# EAGLE design shift controller (EAGLE 9.2.2)
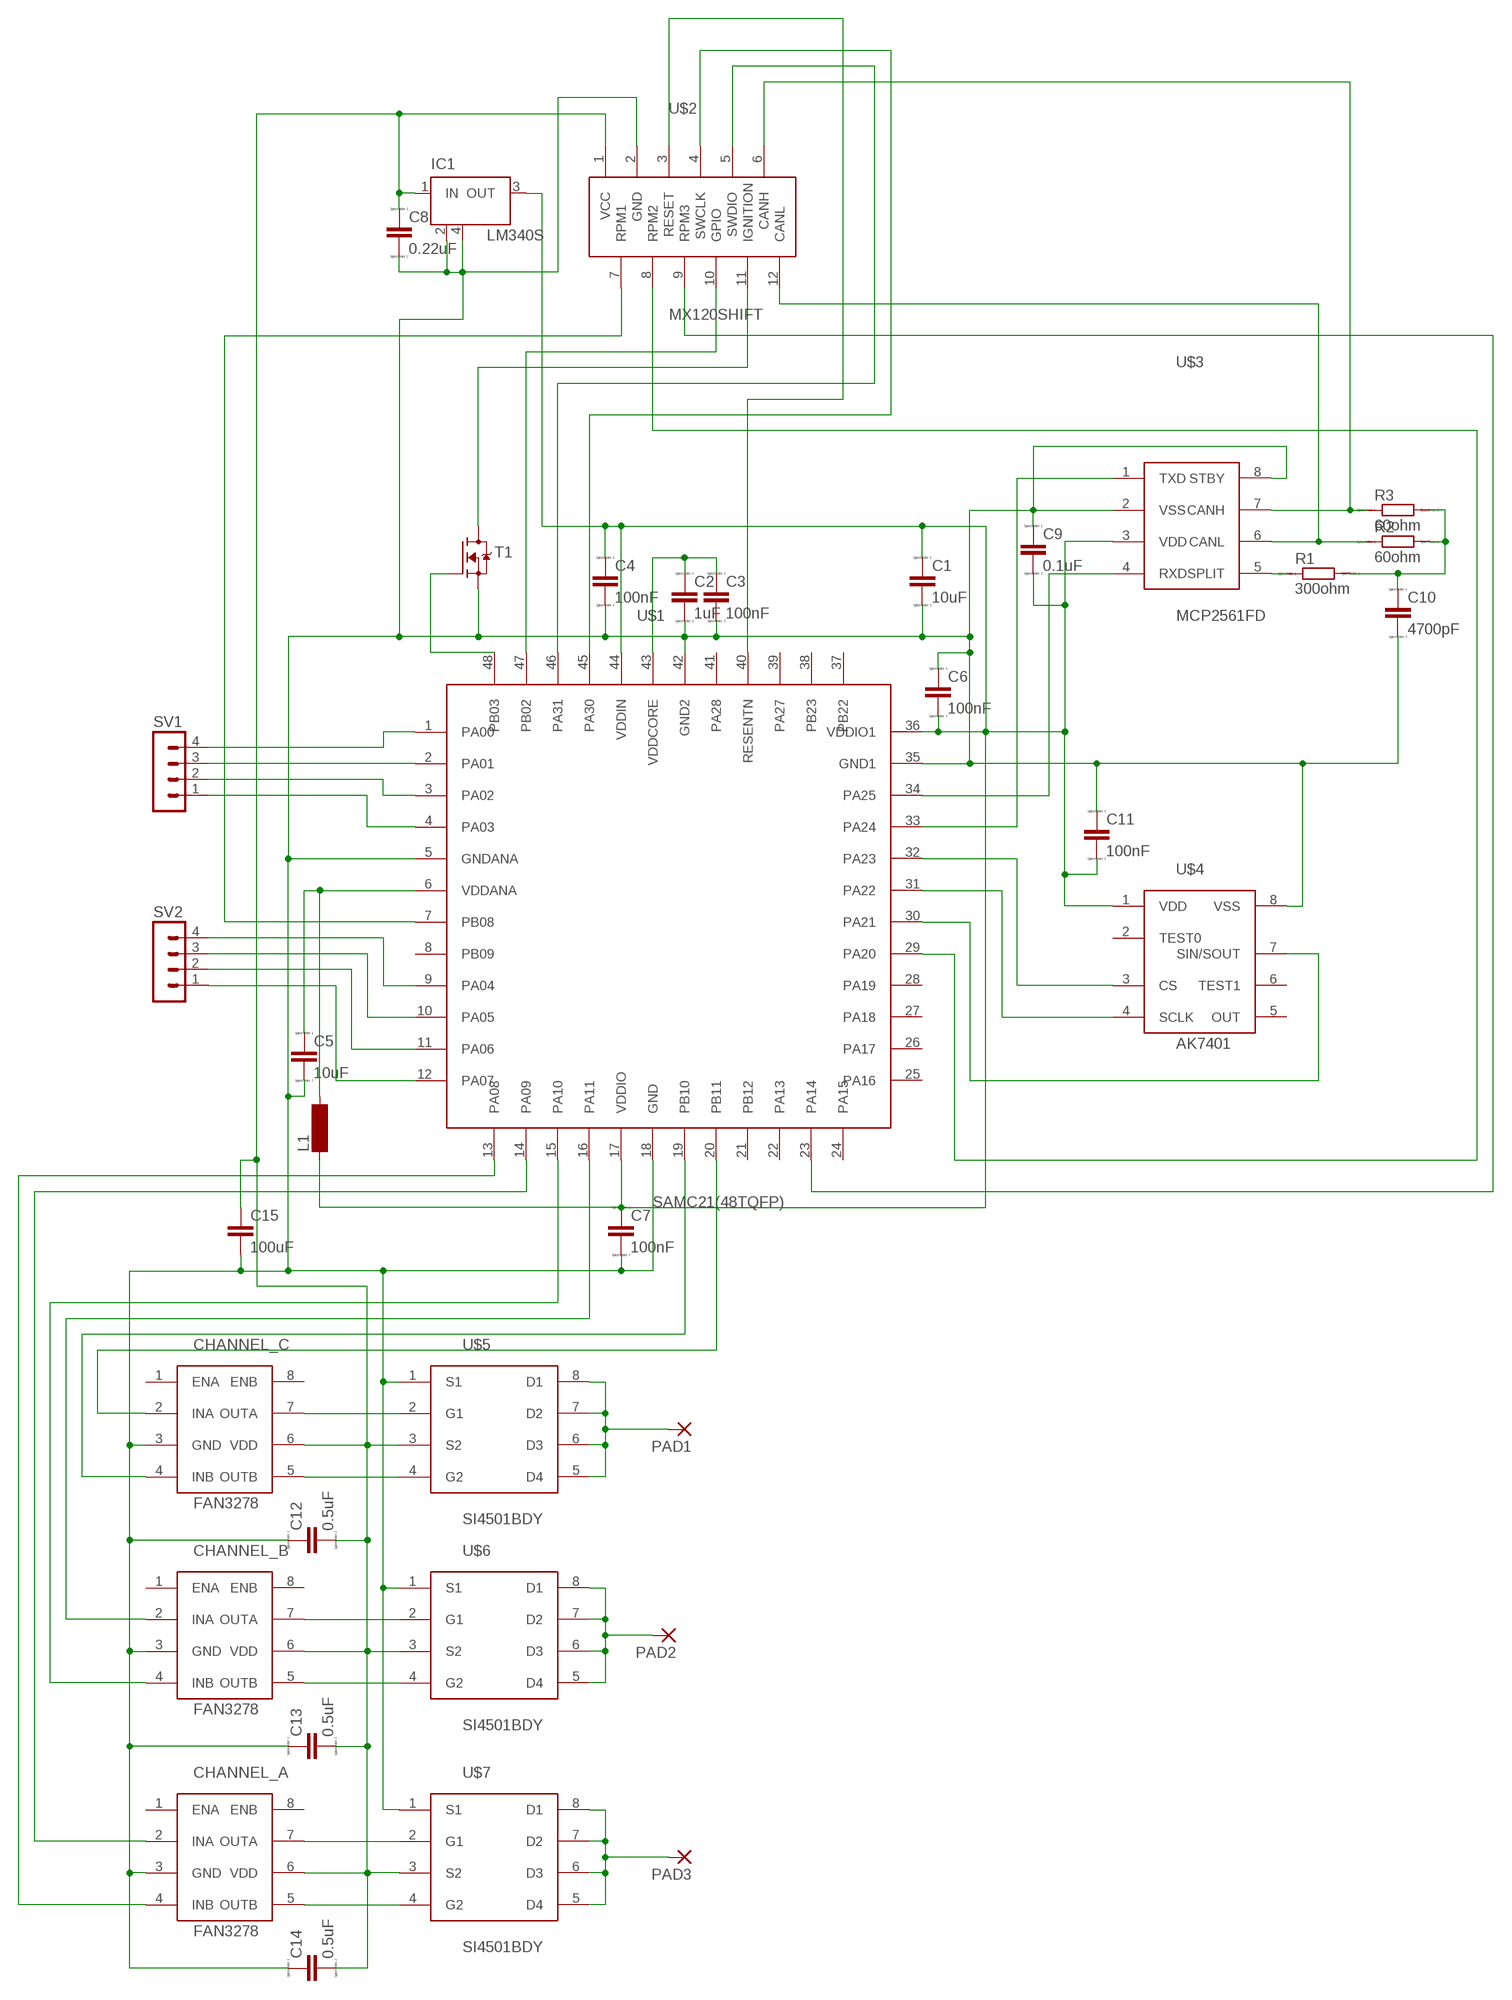
[diagram p0: schematic, sheet 1]

## Parts
C1  10uF  CC1206  [C1206]
C2  1uF  CC1206  [C1206]
C3  100nF  CC1206  [C1206]
C4  100nF  CC1206  [C1206]
C5  10uF  CC1206  [C1206]
C6  100nF  CC1206  [C1206]
C7  100nF  CC1206  [C1206]
C8  0.22uF  CC1206  [C1206]
C9  0.1uF  CC1206  [C1206]
C10  4700pF  CC1206  [C1206]
C11  100nF  CC1206  [C1206]
C12  0.5uF  CC1206  [C1206]
C13  0.5uF  CC1206  [C1206]
C14  0.5uF  CC1206  [C1206]
C15  100uF  C2.5/5  [C2.5-5]
CHANNEL_A  FAN3278  [SOIC-8]
CHANNEL_B  FAN3278  [SOIC-8]
CHANNEL_C  FAN3278  [SOIC-8]
IC1  LM340S  [SOT223]
L1  SM-1206  [SM-1206]
PAD1  3,81/1,4  [3,81/1,4]
PAD2  3,81/1,4  [3,81/1,4]
PAD3  3,81/1,4  [3,81/1,4]
R1  300ohm  RR1206  [R1206]
R2  60ohm  RR1206  [R1206]
R3  60ohm  RR1206  [R1206]
SV1  MA04-1  [MA04-1]
SV2  MA04-1  [MA04-1]
T1  MOSFET-N-SOT223  [SOT223]
U$1  SAMC21(48TQFP)  [TQFP-48]
U$2  MX120SHIFT  [12X3.5PITCH]
U$3  MCP2561FD  [SOIC-8]
U$4  AK7401  [SOIC-8]
U$5  SI4501BDY  [SOIC-8]
U$6  SI4501BDY  [SOIC-8]
U$7  SI4501BDY  [SOIC-8]

## Nets
N$1: U$1.45(PA30) U$2.4(SWCLK)
N$2: U$1.46(PA31) U$2.5(SWDIO)
N$3: U$1.34(PA25) U$3.4(RXD)
N$4: U$1.33(PA24) U$3.1(TXD)
N$5: R3.1 U$2.6(CANH) U$3.7(CANH)
N$6: R2.1 U$2.12(CANL) U$3.6(CANL)
N$7: U$1.40(RESENTN) U$2.3(RESET)
N$8: U$1.7(PB08) U$2.7(RPM1)
N$9: U$1.23(PA14) U$2.9(RPM3)
N$10: U$1.29(PA20) U$2.8(RPM2)
N$11: SV1.4 U$1.1(PA00)
N$12: C8.1 C12.2 C13.2 C14.2 C15.1 CHANNEL_A.6(VDD) CHANNEL_B.6(VDD) CHANNEL_C.6(VDD) IC1.1(IN) U$2.1(VCC) U$5.3(S2) U$6.3(S2) U$7.3(S2)
N$13: C1.1 C4.1 C6.2 C7.1 C9.2 C11.2 IC1.3(OUT) L1.1 U$1.17(VDDIO) U$1.36(VDDIO1) U$1.44(VDDIN) U$3.3(VDD) U$4.1(VDD)
N$14: C2.1 C3.1 U$1.43(VDDCORE)
N$15: C5.1 L1.2 U$1.6(VDDANA)
N$16: R1.1 U$3.5(SPLIT)
N$18: C10.1 R1.2 R2.2 R3.2
N$19: CHANNEL_C.2(INA) U$1.20(PB11)
N$20: U$1.30(PA21) U$4.7(SIN/SOUT)
N$21: U$1.31(PA22) U$4.4(SCLK)
N$22: U$1.32(PA23) U$4.3(CS)
N$23: T1.2(D) T1.4(D) U$2.11(IGNITION)
N$24: T1.1(G) U$1.48(PB03)
N$25: PAD1.1(P) U$5.5(D4) U$5.6(D3) U$5.7(D2) U$5.8(D1)
N$26: PAD2.1(P) U$6.5(D4) U$6.6(D3) U$6.7(D2) U$6.8(D1)
N$27: PAD3.1(P) U$7.5(D4) U$7.6(D3) U$7.7(D2) U$7.8(D1)
N$28: CHANNEL_C.4(INB) U$1.19(PB10)
N$29: CHANNEL_C.7(OUTA) U$5.2(G1)
N$30: CHANNEL_C.5(OUTB) U$5.4(G2)
N$31: CHANNEL_B.7(OUTA) U$6.2(G1)
N$32: CHANNEL_B.5(OUTB) U$6.4(G2)
N$33: CHANNEL_A.7(OUTA) U$7.2(G1)
N$34: CHANNEL_A.5(OUTB) U$7.4(G2)
N$35: C1.2 C2.2 C3.2 C4.2 C5.2 C6.1 C7.2 C8.2 C9.1 C10.2 C11.1 C12.1 C13.1 C14.1 C15.2 CHANNEL_A.3(GND) CHANNEL_B.3(GND) CHANNEL_C.3(GND) IC1.2(GND) IC1.4(GND) T1.3(S) U$1.5(GNDANA) U$1.18(GND) U$1.35(GND1) U$1.42(GND2) U$2.2(GND) U$3.2(VSS) U$3.8(STBY) U$4.8(VSS) U$5.1(S1) U$6.1(S1) U$7.1(S1)
N$36: CHANNEL_B.2(INA) U$1.16(PA11)
N$37: CHANNEL_B.4(INB) U$1.15(PA10)
N$38: CHANNEL_A.2(INA) U$1.14(PA09)
N$39: CHANNEL_A.4(INB) U$1.13(PA08)
N$40: U$1.47(PB02) U$2.10(GPIO)
N$41: SV1.3 U$1.2(PA01)
N$42: SV1.2 U$1.3(PA02)
N$43: SV1.1 U$1.4(PA03)
N$44: SV2.4 U$1.9(PA04)
N$45: SV2.3 U$1.10(PA05)
N$46: SV2.2 U$1.11(PA06)
N$47: SV2.1 U$1.12(PA07)
Unconnected: CHANNEL_A.1(ENA) CHANNEL_A.8(ENB) CHANNEL_B.1(ENA) CHANNEL_B.8(ENB) CHANNEL_C.1(ENA) CHANNEL_C.8(ENB) U$1.8(PB09) U$1.21(PB12) U$1.22(PA13) U$1.24(PA15) U$1.25(PA16) U$1.26(PA17) U$1.27(PA18) U$1.28(PA19) U$1.37(PB22) U$1.38(PB23) U$1.39(PA27) U$1.41(PA28) U$4.2(TEST0) U$4.5(OUT) U$4.6(TEST1)

## Library data of the parts
C1-C14 = eagle-ltspice:C: CAPACITOR, European symbol; SPICEMODEL: NONE; SPICEPREFIX: C
C15 = capacitor-wima:C: CAPACITOR naming: grid - package width
CHANNEL_A CHANNEL_B CHANNEL_C = my library 2:FAN3278: Pmos Nmos bridge driver
IC1 = linear:LM340S: 3-Terminal Positive Regulators Source: http://cache.national.com/ds/LM/LM340.pdf
L1 = inductor-neosid:SM-1206: INDUCTOR SMD chip inductor; OC_FARNELL: unknown; OC_NEWARK: unknown
PAD1-PAD3 = wirepad:3,81/1,4: THROUGH-HOLE PAD
R1-R3 = eagle-ltspice:R: RESISTOR, European symbol; SPICEMODEL: NONE; SPICEPREFIX: R
SV1 SV2 = con-lstb:MA04-1: PIN HEADER; OC_FARNELL: unknown; OC_NEWARK: unknown
T1 = we-transistor:MOSFET-N: N-Channel MOSFET SOT23 N-Chn MOSFET TSM3404, IRLML2502 (Vgs>=+/-20V, Vds<=20V, Id>=3A + Rds<=0.05Ohm @ Vgs=4.5V) BSS138 (Vgs>=+/-20V, Vds<=40V, Id>=0.2A + Rds<=3Ohm @ Vgs=4.5V) SOT223 Low Side Switch with Protection (Infineon) BSP76 (Vin=0...10V, Vds<=42V, Id=1.4A + Rds=0.2Ohm @ Vin=5V) BSP77 (Vin=0...10V, Vds<=42V, Id=2.2A + Rds=0.1Ohm @ Vin=5V) D²Pak Low Side Switch with Protection (Infineon) BTS117TC (Vin=0...10V, Vds<=60V, Id=3.5A + Rds=0.12Ohm @ Vin=5V) BTS133TC (Vin=0...10V, Vds<=60V, Id=7A + Rds=0.06Ohm @ Vin=5V) BTS141TC (Vin=0...10V, Vds<=60V, Id=12A + Rds=0.03Ohm @ Vin=5V) BTS3018TC (Vin=0...10V, Vds<=60V, Id=6A + Rds=0.02Ohm @ Vin=5V)
U$1 = my library:SAMC21(48TQFP): SAM C21 micro in 48-tqfp package
U$2 = my library 2:MX120SHIFT: MX120G connector for rear shift motor controller
U$3 = my library:MCP2561FD: CAN-FD transceiver
U$4 = my library 2:AK7401: Non-contact magnetic encoder
U$5-U$7 = my library 2:SI4501BDY: Pmos Nmos half bridge

## Board
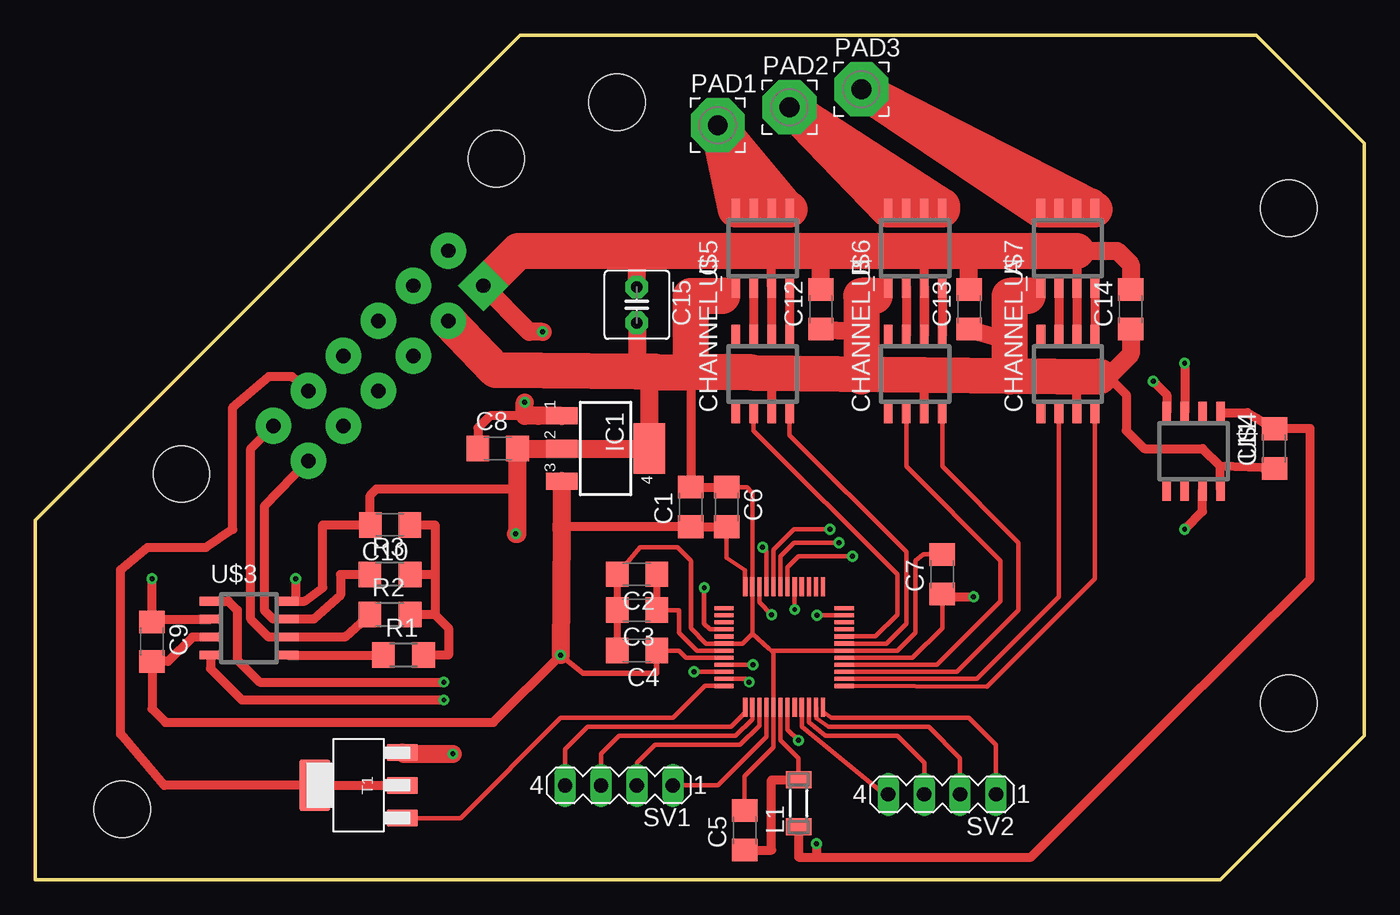
[diagram p1: board, top side]
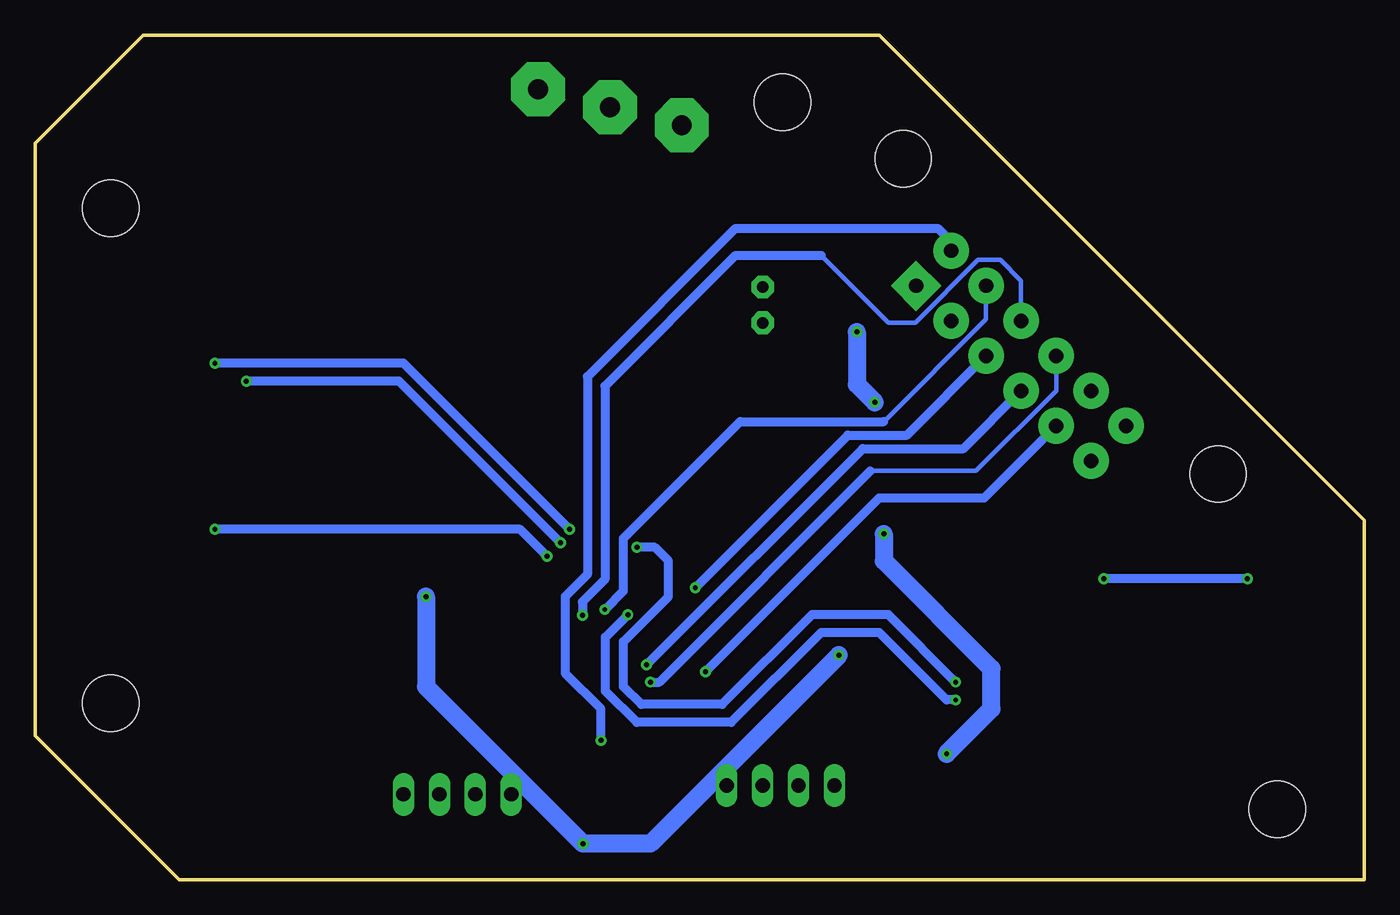
[diagram p2: board, bottom side, seen from below]

Size 93.98 x 59.69 mm. Coordinates in mm from the lower left corner, seen from the top.
Outline: 0,0 83.82,0 93.98,10.16 93.98,52.07 86.36,59.69 34.29,59.69 0,25.4 0,0
Copper layers (1*16): Top 0.035mm / dielectric 1.5mm / Bottom 0.035mm
Design rules "default": minimum track width 6mil, minimum drill 0.35mm, track to track 6mil, track to pad 6mil, pad to pad 6mil, via to via 6mil, smd to smd 6mil, copper to edge 40mil, drill to drill 6mil, minimum pad ring 10mil, minimum via ring 8mil, stop-mask expansion 4mil, vias tented up to drill 0mil, thermal gap 10mil
Holes 4 mm at 88.65,47.46 88.65,12.46 41.15,54.96 6.15,4.96
tRestrict: 1 lines

### Footprints (pad centres in the part's own frame; a part is rotated, then mirrored left to right if it is on the bottom)
C1206 = smd 1.6 x 1.8: 1 -1.4,0; 2 1.4,0
C2.5-5 = drill 0.813 pad 1.6 octagon: 1 -1.27,0; 2 1.27,0
SOIC-8 = smd 1.524 x 0.61: 1 0,3.81; 2 0,2.54; 3 0,1.27; 4 0,0; 5 5.461,0; 6 5.461,1.27; 7 5.461,2.54; 8 5.461,3.81
SOT223 = smd 1.219 x 2.235: 1 -2.311,-3.099; 2 0,-3.099; 3 2.311,-3.099 | smd 3.6 x 2.2: 4 0,3.099
SM-1206 = smd 1.2 x 1.8: 1 -1.65,0; 2 1.65,0
3,81/1,4 = drill 1.397 pad 3.81 octagon: 1 0,0
R1206 = smd 1.6 x 1.803: 1 -1.422,0; 2 1.422,0
MA04-1 = drill 1.016 long: 1 -3.81,0; 2 -1.27,0; 3 1.27,0; 4 3.81,0
SOT223' = smd 2.235 x 1.219: 1 -3.099,2.311; 2 -3.099,0; 3 -3.099,-2.311 | smd 2.2 x 3.6: 4 3.099,0
TQFP-48 = smd 1.35 x 0.29: 1 -4,2.5; 2 -4,2; 3 -4,1.5; 4 -4,1; 5 -4,0.5; 6 -4,0; 7 -4,-0.5; 8 -4,-1; 9 -4,-1.5; 10 -4,-2; 11 -4,-2.5; 12 -4,-3; 25 4.5,-3; 26 4.5,-2.5; 27 4.5,-2; 28 4.5,-1.5; 29 4.5,-1; 30 4.5,-0.5; 31 4.5,0; 32 4.5,0.5; 33 4.5,1; 34 4.5,1.5; 35 4.5,2; 36 4.5,2.5 | smd 0.29 x 1.35: 13 -2.5,-4.5; 14 -2,-4.5; 15 -1.5,-4.5; 16 -1,-4.5; 17 -0.5,-4.5; 18 0,-4.5; 19 0.5,-4.5; 20 1,-4.5; 21 1.5,-4.5; 22 2,-4.5; 23 2.5,-4.5; 24 3,-4.5; 37 3,4; 38 2.5,4; 39 2,4; 40 1.5,4; 41 1,4; 42 0.5,4; 43 0,4; 44 -0.5,4; 45 -1,4; 46 -1.5,4; 47 -2,4; 48 -2.5,4
12X3.5PITCH = drill 1 pad 2.54 square: 1 0,3.5 | drill 1 pad 2.54: 2 3.5,3.5; 3 7,3.5; 4 10.5,3.5; 5 14,3.5; 6 17.5,3.5; 7 0,0; 8 3.5,0; 9 7,0; 10 10.5,0; 11 14,0; 12 17.5,0 | hole 3.988: -7,-2.2; 24.5,-2.2

### Placement (x,y rotation side)
C1  46.35,26.35 90 top
C2  42.55,21.59 180 top
C3  42.55,19.05 180 top
C4  42.55,16.19 180 top
C5  50.16,3.49 90 top
C6  48.89,26.35 270 top
C7  64.14,21.59 90 top
C8  32.7,30.48 0 top
C9  8.26,16.83 270 top
C10  25.08,25.08 180 top
C11  87.63,30.48 90 top
C12  55.56,40.32 90 top
C13  66.04,40.32 90 top
C14  77.47,40.32 90 top
C15  42.55,40.64 270 top
CHANNEL_A  74.93,33.02 90 top
CHANNEL_B  64.14,33.02 90 top
CHANNEL_C  53.34,33.02 90 top
IC1  40.32,30.48 270 top
L1  53.98,5.4 90 top
PAD1  48.26,53.34 0 top
PAD2  53.34,54.61 0 top
PAD3  58.42,55.88 0 top
R1  26.03,15.88 0 top
R2  25.08,18.73 0 top
R3  25.08,21.59 0 top
SV1  41.27,6.67 180 top
SV2  64.14,6.03 180 top
T1  [SOT223']  22.86,6.67 180 top
U$1  52.7,16.19 90 top
U$2  29.21,44.45 225 top
U$3  12.38,15.88 0 top
U$4  80.01,33.02 270 top
U$5  53.34,41.91 90 top
U$6  64.14,41.91 90 top
U$7  74.93,41.91 90 top

### Tracks (layer width: path | path; a pad name or v marks a point on that pad's centre or on a via)
N$1  (via drill 0.35)
  Top 0.305: U$1.45 v50.75,15.19
  Bottom 0.635: v50.75,15.19 35.46,30.48 28.33,30.48 U$2.4
N$2  (via drill 0.35)
  Top 0.305: U$1.46 v46.59,14.69
  Bottom 0.635: v46.59,14.69 34.29,26.99 26.87,26.99 U$2.5
N$3  (via drill 0.35)
  Top 0.305: v52.07,18.73 51.2,19.6 U$1.34
  Top 0.635: U$3.4 12.38,14.92 14.6,12.7 v28.89,12.7
  Bottom 0.635: v28.89,12.7 29.53,12.7 34.29,17.46 38.42,17.46 44.77,11.11 51.43,11.11 53.66,13.34 53.66,17.14 v52.07,18.73
N$4  (via drill 0.35)
  Top 0.305: v51.43,23.5 51.7,23.23 U$1.33
  Top 0.635: U$3.1 13.65,19.69 14.29,19.05 14.29,15.56 15.88,13.97 v28.89,13.97
  Bottom 0.635: v28.89,13.97 33.66,18.73 39.05,18.73 45.4,12.38 51.12,12.38 52.39,13.65 52.39,16.83 49.21,20 49.21,22.54 50.16,23.5 v51.43,23.5
N$5
  Top 0.635: U$2.6 16.19,26.38 16.19,19.05 16.83,18.41 U$3.7 19.69,18.41 21.59,20.11 21.59,21.59 R3.1
N$6
  Top 0.635: U$2.12 15.24,30.48 15.24,18.41 16.51,17.14 U$3.6 21.91,17.14 R2.1 23.21,18.28
N$7  (via drill 0.35)
  Top 0.305: U$1.40 47.71,17.69 47.31,18.1 v47.31,20.64
  Bottom 0.635: v47.31,20.64 36.51,31.43 32.33,31.43 U$2.3
N$8  (via drill 0.35)
  Top 0.305: U$1.7 53.2,10.61 v53.98,9.84
  Bottom 0.635: v53.98,9.84 53.98,12.07 56.52,14.61 56.52,20 54.93,21.59 54.93,35.56 44.45,46.04 30.16,46.04 29.21,45.09 U$2.7
N$9  (via drill 0.35)
  Top 0.305: U$1.23 v55.28,18.69
  Bottom 0.305: 38.42,44.13 33.66,39.37 31.75,39.37 27.3,43.81 25.72,43.81 24.26,42.36 U$2.9
  Bottom 0.635: v55.28,18.69 55.28,19.64 53.7,21.23 53.7,34.88 44.45,44.13 38.42,44.13
N$10  (via drill 0.35)
  Top 0.305: U$1.29 v53.7,19.1
  Bottom 0.305: 33.97,32.38 26.73,39.62 U$2.8
  Bottom 0.635: v53.7,19.1 52.39,20.41 52.39,24.13 44.13,32.38 33.97,32.38
N$11
  Top 0.305: SV1.4 37.46,9.21 39.05,10.8 49.21,10.8 50.2,11.79 U$1.1
N$12  (via drill 0.35)
  Top 0.635: CHANNEL_C.6 U$5.3 52.07,44.45 | U$6.3 CHANNEL_B.6 62.87,44.45 | CHANNEL_A.6 U$7.3 73.66,44.45 | 34.61,32.79 32.16,32.79 31.3,31.94 C8.1
  Top 1.27: C15.1 42.55,44.45 | C12.2 55.56,44.45 | C13.2 66.04,44.45 | 73.66,44.45 76.52,44.45 77.47,43.5 C14.2 | IC1.1 35.56,32.79 34.61,32.79 v34.61,33.74 | v35.88,38.73 34.92,38.73 U$2.1
  Top 2.54: 73.66,44.45 66.04,44.45 62.87,44.45 55.56,44.45 52.07,44.45 42.55,44.45 34.16,44.45 U$2.1
  Bottom 0.635: 34.61,33.66 v34.61,33.74
  Bottom 1.27: v35.88,38.73 35.88,35.01 v34.61,33.74
N$13  (via drill 0.35)
  Top 0.305: U$1.17 62.05,15.69 64.14,17.78 C7.1 | U$1.36 50.2,21.88 48.89,22.75 C6.2 | U$1.44 46.03,15.69 45.53,16.19 C4.1
  Top 0.406: v37.15,15.87 38.73,14.61 43.95,14.61 C4.1 | C1.1
  Top 0.635: L1.1 53.98,1.59 55.24,1.59 | 55.24,1.59 70.42,1.59 79.95,11.11 90.17,21.27 90.17,31.88 C11.2 85.73,33.02 U$4.1 | U$3.3 11.11,17.14 9.39,15.43 C9.2 8.26,12.07 9.21,11.11 32.38,11.11 v37.15,15.87 | C6.2 C1.1 37.21,24.95 | v55.24,2.54 55.24,1.59 | C7.1 64.32,20 v66.36,20
  Top 1.27: IC1.3 37.21,25.08 | 37.21,25.09 37.21,25.08 | 37.21,24.77 | 37.21,24.77 v37.15,15.87 | 37.21,24.77 37.21,24.95 37.21,25.08
  Bottom 1.27: v37.15,15.87 50.48,2.54 v55.24,2.54 66.36,13.65 v66.36,20
N$14
  Top 0.305: U$1.43 46.8,16.19 45.53,17.46 45.53,19.05 C3.1
  Top 0.508: C2.1 C3.1
N$15
  Top 0.305: U$1.6 52.7,9.84 53.98,8.57 L1.2
  Top 0.635: C5.1 52.07,2.09 52.07,7.05 L1.2
N$16
  Top 0.635: U$3.5 R1.1
N$17
  Top 0.635: 49.53,42.23 48.58,42.23
N$18
  Top 0.635: R3.2 28.26,21.59 | 28.26,21.59 28.26,18.73 | 28.26,18.73 R2.2 | 28.26,18.73 29.21,17.78 29.21,15.88 R1.2 | C10.1 28.26,25.08 28.26,21.59
N$19
  Top 0.305: U$1.20 59.42,17.19 60.96,18.73 60.96,21.59 50.8,31.75 CHANNEL_C.2
N$20  (via drill 0.35)
  Top 0.305: U$1.30 53.2,22.09 53.98,22.86 v57.79,22.86
  Top 0.635: v81.28,24.77 82.55,26.04 U$4.7
  Bottom 0.635: v57.79,22.86 59.69,24.77 v81.28,24.77
N$21  (via drill 0.35)
  Top 0.305: U$1.31 52.7,22.86 53.66,23.81 v56.83,23.81
  Top 0.635: v79.06,35.24 80.01,34.29 U$4.4
  Bottom 0.635: v56.83,23.81 68.26,35.24 v79.06,35.24
N$22  (via drill 0.35)
  Top 0.305: U$1.32 52.2,23.31 53.66,24.77 v56.2,24.77
  Top 0.635: v81.28,36.51 U$4.3
  Bottom 0.635: v56.2,24.77 67.95,36.51 v81.28,36.51
N$23
  Top 0.635: U$2.11 18.15,35.56 16.51,35.56 13.97,33.38 13.97,24.77 12.06,23.5 7.94,23.5 6.03,21.91 6.03,10.31 9.13,6.67 T1.4 T1.2
N$24
  Top 0.305: T1.1 30.07,4.36 37.15,11.43 45.09,11.43 47.35,13.69 U$1.48
N$25
  Top 2.54: U$5.5 U$5.6 U$5.7 U$5.8 PAD1.1 53.02,47.62 50.8,48.26
N$26
  Top 2.54: U$6.5 U$6.6 U$6.7 U$6.8 PAD2.1 64.14,47.62
N$27
  Top 2.54: U$7.5 U$7.6 U$7.7 U$7.8 PAD3.1 74.61,47.62
N$28
  Top 0.305: CHANNEL_C.4 53.34,31.43 61.59,23.18 61.59,18.1 60.19,16.69 U$1.19
N$29
  Top 0.635: U$5.2 CHANNEL_C.7
N$30
  Top 0.635: U$5.4 CHANNEL_C.5
N$31
  Top 0.635: U$6.2 CHANNEL_B.7
N$32
  Top 0.635: U$6.4 CHANNEL_B.5
N$33
  Top 0.635: U$7.2 CHANNEL_A.7
N$34
  Top 0.635: U$7.4 CHANNEL_A.5
N$35  (via drill 0.35)
  Top 0.305: 50.7,17.37 50.03,16.69 U$1.42 47.44,16.69 46.35,17.78 46.35,22.54 45.4,23.5 42.75,23.5 41.18,21.6 C2.2 | 50.7,17.37 U$1.35 50.7,27.3 50.32,27.75 C6.1 | 52.07,16.19 U$1.18 60.96,16.19 62.23,17.46 62.23,22.54 62.79,22.99 C7.2 | 51.88,16.32 51.88,16.33 | 51.88,16.33 50.7,17.37 | 51.88,16.33 52.07,16.19 | 52.07,16.19 52.2,16 U$1.5 52.2,9.34 50.16,7.3 C5.2
  Top 0.508: C4.2 C3.2 C2.2
  Top 0.635: U$7.1 70.48,41.27 70.17,41.27 | U$6.1 59.69,41.27 59.37,41.27 | U$5.1 48.89,41.27 48.58,41.27 | 73.66,35.56 68.9,35.56 62.87,35.56 | 62.87,35.56 58.42,35.56 52.7,35.56 52.07,34.93 CHANNEL_C.3 | CHANNEL_B.3 62.87,35.56 | U$4.8 83.82,29.21 | 83.82,29.21 82.55,30.48 78.42,30.48 77.15,31.75 77.15,34.29 75.88,35.56 75.25,35.56 73.66,35.56 | CHANNEL_A.3 73.66,35.56 | C11.1 83.82,29.21 | U$3.8 18.41,19.69 | 18.41,19.69 19.05,19.69 20.32,20.64 20.32,25.08 C10.2 23.68,27.18 24.13,27.62 34.1,27.62 | U$3.2 8.44,18.41 C9.1 v8.26,21.27 | C6.1 C1.2 46.35,35.88 | 34.1,29.02 34.1,29.84 C8.2 | v18.41,21.27 18.41,19.69
  Top 1.27: C12.1 58.42,38.73 | C13.1 68.9,38.1 | C14.1 77.47,37.15 75.88,35.56 | C15.2 42.54,35.92 | 43.42,35.91 IC1.4 IC1.2 C8.2 | T1.3 26.05,8.89 v29.53,8.89 | v33.97,24.45 34.1,24.45 34.1,27.62 34.1,29.84
  Top 2.54: 48.58,41.27 46.35,41.27 46.35,35.88 | 70.17,41.27 68.9,41.27 68.9,38.1 68.9,35.56 | 59.37,41.27 58.42,41.27 58.42,38.73 58.42,35.56 | 75.25,35.56 75.24,35.57 50.7,35.84 50.67,35.87 46.37,35.87 46.35,35.88 | U$2.2 29.21,39.48 32.56,36.03 42.54,35.92 43.16,35.91 43.42,35.91 43.81,35.91 43.84,35.88 46.35,35.88 | 46.35,35.88 | 46.35,35.88
  Bottom 0.635: v8.26,21.27 v18.41,21.27
  Bottom 1.27: v29.53,8.89 26.35,12.07 26.35,14.92 33.97,22.54 v33.97,24.45
N$36
  Top 0.305: CHANNEL_B.2 61.59,29.21 68.26,22.54 68.26,19.69 63.77,15.19 U$1.16
N$37
  Top 0.305: U$1.15 65.18,14.69 69.53,19.05 69.53,23.81 64.14,29.21 CHANNEL_B.4
N$38
  Top 0.305: CHANNEL_A.2 72.39,20 66.58,14.19 U$1.14
N$39
  Top 0.305: U$1.13 67.31,13.65 74.93,21.27 CHANNEL_A.4
N$40  (via drill 0.35)
  Top 0.305: U$1.47 50.26,14.19 v50.48,13.97
  Bottom 0.305: 34.92,28.89 27.47,28.89 21.79,34.58 U$2.10
  Bottom 0.635: v50.48,13.97 49.85,13.97 34.92,28.89
N$41
  Top 0.305: SV1.3 40,8.89 41.27,10.16 49.53,10.16 50.7,11.34 U$1.2
N$42
  Top 0.305: SV1.2 42.55,8.25 43.81,9.52 49.85,9.52 51.2,10.88 U$1.3
N$43
  Top 0.305: SV1.1 48.3,6.67 51.7,10.12 U$1.4
N$44
  Top 0.305: SV2.4 60.04,6.03 54.2,10.81 U$1.9
N$45
  Top 0.305: SV2.3 62.87,8.25 60.96,10.16 55.88,10.16 54.7,11.11 U$1.10
N$46
  Top 0.305: SV2.2 65.41,8.57 63.18,10.8 56.09,10.8 55.25,11.42 55.23,12.16 U$1.11
N$47
  Top 0.305: SV2.1 67.95,9.52 66.04,11.43 56.3,11.43 55.7,11.88 U$1.12
N$49
  Top 0.635: 59.37,42.23 60.32,42.23
N$50
  Top 0.635: 71.12,42.23 70.17,42.23